# Altium schematic sheet Main.SchDoc
size A
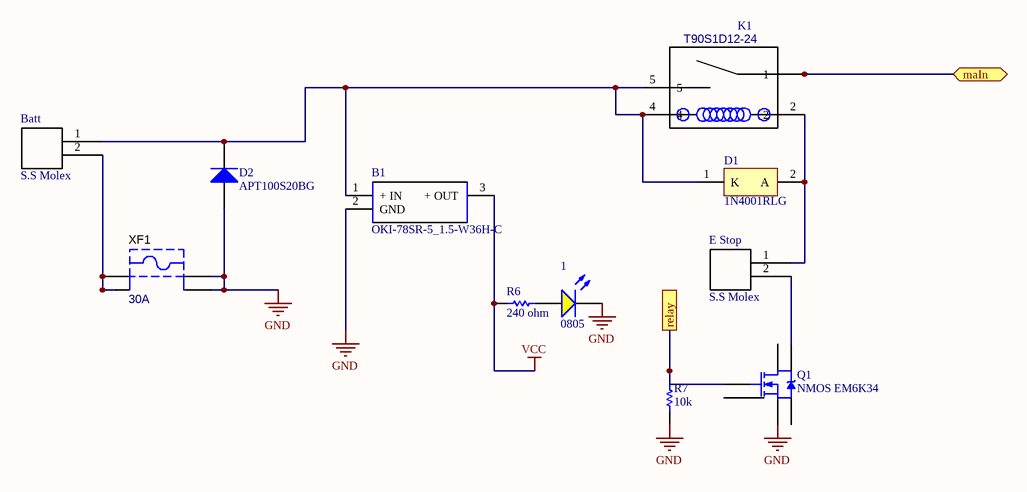
[diagram p0: Main.SchDoc]

## Parts
1  0805  [LTST-C170YKT_V]
B1  OKI-78SR-5_1.5-W36H-C  [OKI-78SR-HORIZONTAL]
Batt  S.S Molex  [1510482204]
D1  1N4001RLG  [ONSC-AXIAL_LEAD-2-59-10_P]
D2  APT100S20BG  [SMC]
E_Stop  S.S Molex  [1510482204]
K1  T90S1D12-24  [TE_1-1393209-6]
Q1  NMOS EM6K34  [*SOT50P160X55-6N]
R6  240 ohm  [RESC0805(2012)_N]
R7  10k  [RESC0805(2012)_N]
XF1  30A  [KSTN-3568_V]

## Ports
maIn (bidir), relay

## Nets
GND: 1.C B1.2(GND) D2.3(A) Q1.4(S) R7.1 XF1.3 XF1.4
VCC: B1.3(+_OUT) R6.2
maIn: K1.1 K1.3 ; port maIn
relay: Q1.5(G) R7.2 ; port relay
NetB1_1: B1.1(+_IN) Batt.1 D1.1(K) D2.2(K) K1.4 K1.5
NetBatt_2: Batt.2 XF1.1 XF1.2
NetD1_2: D1.2(A) E_Stop.1 K1.2
NetE_Stop_2: E_Stop.2 Q1.3(D)

Not connected (* = marked no-connect by the designer): 1 A; Q1 1(S) 2(G) 6(D); R6 1

## Library data of the parts
1 = CMP-1674-00003-2: LED YELLOW CLEAR 0805 SMD; PartNumber: LTST-C170YKT; ComponentLink1Description: Datasheet; PackageReference: C170YKT; ComponentLink1URL: http://media.digikey.com/pdf/Data Sheets/Lite-On PDFs/LTST-C170YKT.pdf
B1 = OKI-78SR-5_1.5-W36H-C: Switching Regulator 7-36Vin 5Vo 1.5A Non-Isolated DC-DC Converter, 5V dc Output, 1.5A; Manufacturer_Name: Murata Electronics; Manufacturer_Part_Number: OKI-78SR-5/1.5-W36H-C; Mouser Part Number: 580-OKI78SR51.5W36HC; Datasheet Link: https://componentsearchengine.com/Datasheets/1/OKI-78SR-5_1.5-W36H-C.pdf; ComponentLink1Description: datasheet; ComponentLink1URL: https://power.murata.com/pub/data/power/oki-78sr.pdf
Batt E_Stop = Molex 6.5MM 2 pin connector: Molex 6.5MM 2 pin connector, used for power connections. P/N 1510482204 and similar models.
D1 = CMP-0902-00204-1: Standard Recovery Rectifier, 2-Pin Axial_Lead, Pb-Free, Tape and Reel; Manufacturer: On Semiconductor; IO(rec) Max (A): 1; VRRM Max (V): 50; IFSM Max (A): 30; ComponentLink2URL: http://www.onsemi.com/pub_link/Collateral/1N4001-D.PDF; PartNumber: 1N4001RLG; PackageReference: AXIAL_LEAD-2-59-10; PackageDescription: 2-Pin, Axial Lead, Diameter 2.35 mm; ComponentLink3Description: Package Specification; Packing: Tape and Reel; ComponentLink2Description: Datasheet; Type: Standard Recovery; DatasheetVersion: Rev. 13; RoHS: TRUE; ComponentLink3URL: http://www.onsemi.cn/pub_link/Collateral/59-10.PDF; PackageVersion: Rev. U, 02/2005; ComponentLink1Description: Manufacturer URL; Mounting Technology: Through Hole; ComponentLink1URL: http://www.onsemi.com/
D2 = Diode: Default Diode; Published: 8-Jun-2000; LatestRevisionDate: 17-Jul-2002; LatestRevisionNote: Re-released for DXP Platform.; PackageVersion: Sep-1996; PackageReference: SMC; Publisher: Altium Limited; PackageDescription: DO-214-AB/SMC; 2 C-Bend Leads; Body 7.9 x 5.9 mm, inc. leads (LxW); Code_JEDEC: DO-214-AB; ComponentLink1Description: datasheet; ComponentLink1URL: file:///C:/Users/Me/Downloads/Microsemi_APT100S20BG_High-Voltage_Schottky_Diode_Datasheet_D%20(1).PDF
K1 = 1-1393209-6: MF: TE Connectivity; Package: None; MP: T90S1D12-24; TE_purchase_URL: https://www.te.com/usa-en/product-1-1393209-6.html?te_bu=Cor&te_type=disp&te_campaign=seda_glo_cor-seda-global-disp-prtnr-fy19-seda-model-bom-cta_sma-317_1&elqCampaignId=32493; SnapEDA_Link: https://www.snapeda.com/parts/T90S1D12-24/TE%20Connectivity%20Potter%20%26%20Brumfield%20Relays/view-part/?ref=snap; Availability: Unavailable; Price: None; Value: *; ComponentLink1Description: datasheet; ComponentLink1URL: https://media.digikey.com/pdf/Data%20Sheets/Tyco%20Electronics%20P%20B%20PDFs/T90_Rev0214.pdf
Q1 = NMOS-2: N-Channel Power MOSFET; Note: Pin 2 is electrically connected to pin 4.; Published: 8-Jun-2000; LatestRevisionDate: 17-Jul-2002; LatestRevisionNote: Re-released for DXP Platform.; DatasheetVersion: PD-9.814; PackageVersion: Feb-1997; PackageReference: TO-220AB; Publisher: Altium Limited; PackageDescription: TO, Thru-Hole, Vertical, Heatsink Mounted; 3 In-Line Leads; Pitch 2.54 mm; ComponentLink2Description: datasheet; ComponentLink2URL: http://rohmfs.rohm.com/en/products/databook/datasheet/discrete/transistor/mosfet/em6k34.pdf; ComponentLink3Description: info; ComponentLink3URL: https://www.electronics-tutorials.ws/blog/relay-switch-circuit.html
R6 R7 = CMP-1013-00418-1: 160R 0.125W 1% 0805 (2012 Metric)  SMD; Case-Metric: 2012; Case-EIA: 0805; Value: 160.00 Ohm; Technology: SMT; Tolerance: 1 %; Power: 0.125 W
XF1 = CMP-2000-05464-1: Fuse Holder, 30; Manufacturer: Keystone; Package Reference: 3568; Datasheet Version: 04/2013; Datasheet URL: https://datasheet.ciiva.com/16294/m60-2p40-16294706.pdf; Manufacturer URL: http://www.keyelco.com/; Mounting Technology: ThroughHole; Package Description: 4-Pin Through Hole Device, Body 16 x 6.73 mm, Pitch 9.9 mm; ComponentLink2Description: Holder; ComponentLink2URL: https://www.digikey.com/product-detail/en/keystone-electronics/3568/36-3568-ND/2137306; ComponentLink3Description: Fuse; ComponentLink3URL: https://www.digikey.com/product-detail/en/littelfuse-inc/0997030.WXN/F1878-ND/701063